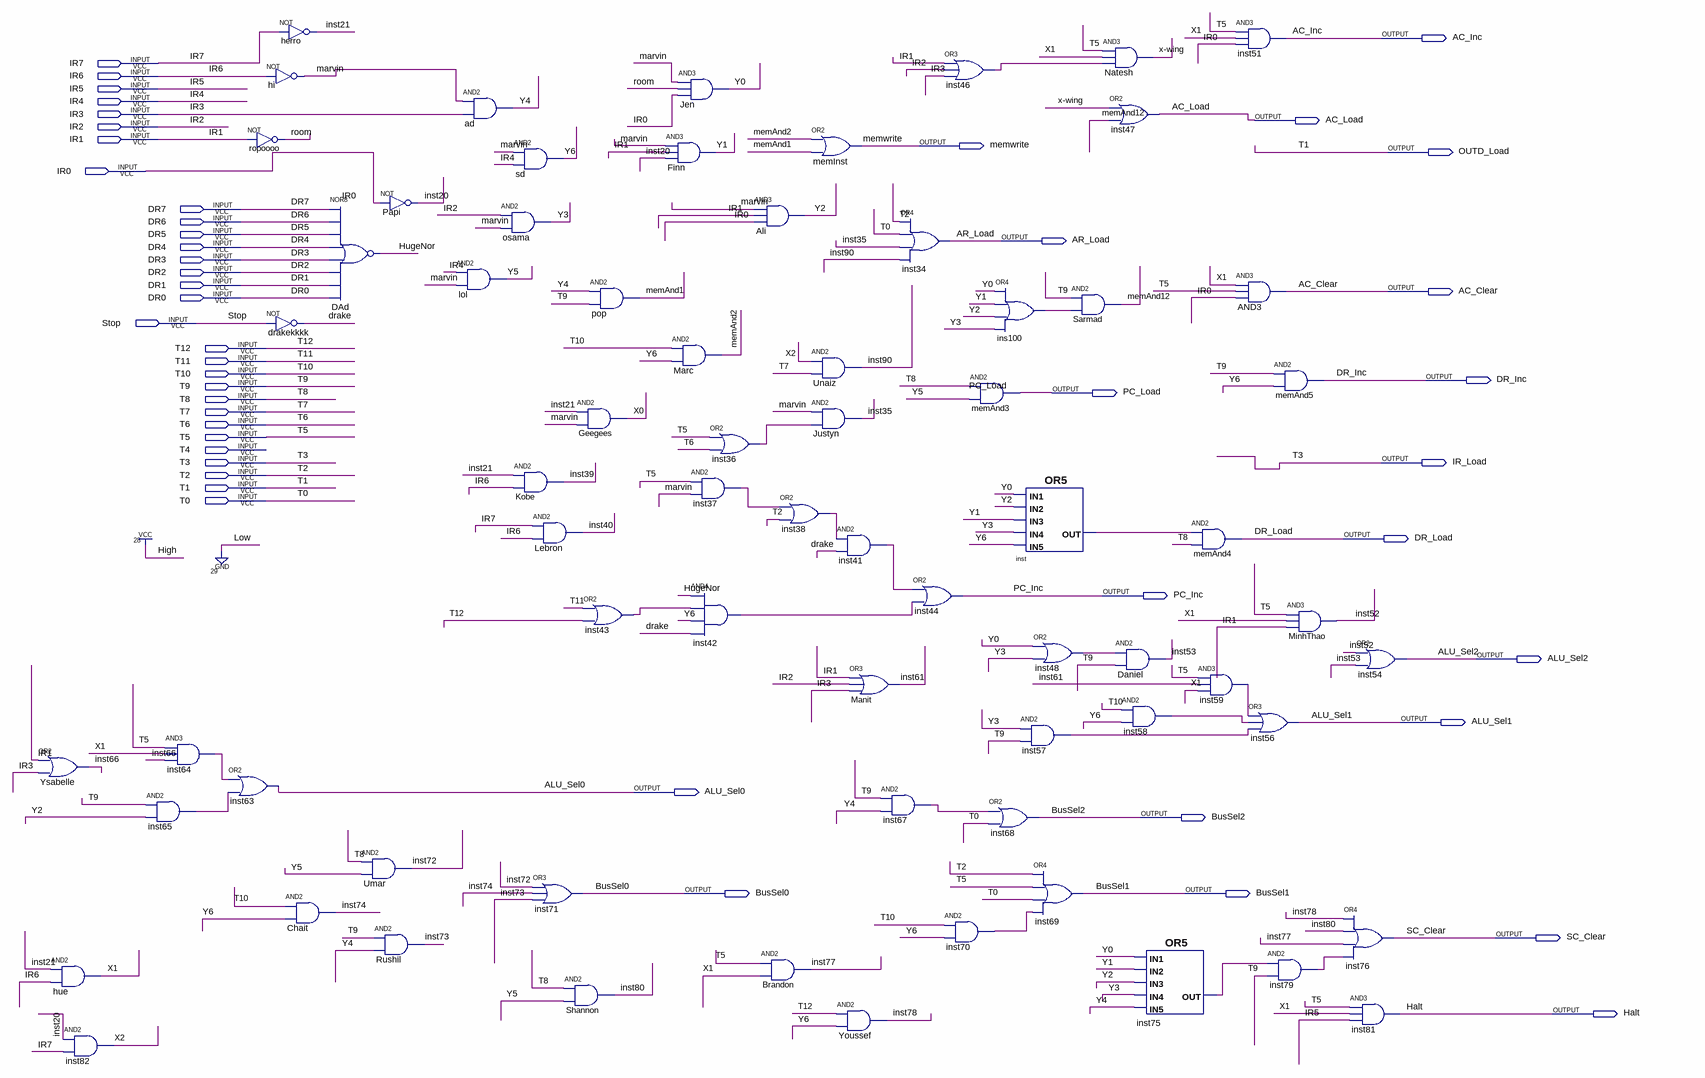
[diagram p0: schematic sheet]
// Quartus schematic lab3controller.bdf as structural Verilog: 70 symbols, 49 pins
module lab3controller (
  input  IR7,
  input  IR6,
  input  IR5,
  input  IR4,
  input  IR3,
  input  IR2,
  input  IR1,
  input  IR0,
  input  DR7,
  input  DR6,
  input  DR5,
  input  DR4,
  input  DR3,
  input  DR2,
  input  DR1,
  input  DR0,
  input  Stop,
  input  T12,
  input  T11,
  input  T10,
  input  T9,
  input  T8,
  input  T7,
  input  T6,
  input  T5,
  input  T4,
  input  T3,
  input  T2,
  input  T1,
  input  T0,
  output AC_Inc,
  output AC_Load,
  output memwrite,
  output OUTD_Load,
  output AR_Load,
  output AC_Clear,
  output DR_Inc,
  output PC_Load,
  output IR_Load,
  output DR_Load,
  output PC_Inc,
  output ALU_Sel2,
  output ALU_Sel1,
  output ALU_Sel0,
  output BusSel2,
  output BusSel0,
  output BusSel1,
  output SC_Clear,
  output Halt
);

  wire drake, HugeNor, ins100_out, inst20, inst21, inst35, inst36_out, inst37_out, inst38_out, inst39,
       inst40, inst41_out, inst42_out, inst43_out, inst46_out, inst48_out, inst52, inst53, inst57_out,
       inst58_out, inst59_out, inst61, inst64_out, inst65_out, inst66, inst67_out, inst70_out, inst72,
       inst73, inst74, inst75_out, inst77, inst78, inst79_out, inst80, inst90, inst_out, marvin, memAnd1,
       memAnd2, memAnd12, room, X0, X1, X2, \x-wing , Y0, Y1, Y2, Y3, Y4, Y5, Y6;

  or Ysabelle (inst66, IR1, IR3);
  and hue (X1, inst21, IR6);
  and inst82 (X2, inst20, IR7);
  and inst65 (inst65_out, T9, Y2);
  and inst64 (inst64_out, T5, X1, inst66);
  not ropoooo (room, IR1);
  or inst63 (ALU_Sel0, inst64_out, inst65_out);
  not herro (inst21, IR7);
  not hi (marvin, IR6);
  not drakekkkk (drake, Stop);
  and Chait (inst74, T10, Y6);
  nor DAd (HugeNor, DR7, DR6, DR5, DR4, DR3, DR2, DR1, DR0);
  not Papi (inst20, IR0);
  and Umar (inst72, T8, Y5);
  and Rushil (inst73, T9, Y4);
  and lol (Y5, IR4, marvin);
  and ad (Y4, marvin, IR3);
  and osama (Y3, IR2, marvin);
  and sd (Y6, marvin, IR4);
  and Kobe (inst39, inst21, IR6);
  and Lebron (inst40, IR7, IR6);
  or inst71 (BusSel0, inst72, inst74, inst73);
  and pop (memAnd1, Y4, T9);
  and Geegees (X0, inst21, marvin);
  or inst43 (inst43_out, T11, T12);
  and Shannon (inst80, T8, Y5);
  and Jen (Y0, marvin, room, IR0);
  and Finn (Y1, marvin, IR1, inst20);
  and Marc (memAnd2, T10, Y6);
  or inst36 (inst36_out, T5, T6);
  and inst37 (inst37_out, T5, marvin);
  and inst42 (inst42_out, HugeNor, inst43_out, Y6, drake);
  and Ali (Y2, marvin, IR1, IR0);
  and Brandon (inst77, T5, X1);
  or memInst (memwrite, memAnd2, memAnd1);
  and Unaiz (inst90, X2, T7);
  and Justyn (inst35, marvin, inst36_out);
  or inst38 (inst38_out, inst37_out, T2);
  and inst41 (inst41_out, inst38_out, drake);
  or Manit (inst61, IR1, IR2, IR3);
  and Youssef (inst78, T12, Y6);
  or inst34 (AR_Load, T2, T0, inst35, inst90);
  or inst44 (PC_Inc, inst41_out, inst42_out);
  and inst67 (inst67_out, T9, Y4);
  or inst46 (inst46_out, IR1, IR2, IR3);
  and inst70 (inst70_out, T10, Y6);
  or ins100 (ins100_out, Y0, Y1, Y2, Y3);
  and memAnd3 (PC_Load, T8, Y5);
  or inst (inst_out, Y0, Y2, Y1, Y3, Y6);
  or inst68 (BusSel2, inst67_out, T0);
  or inst48 (inst48_out, Y0, Y3);
  and inst57 (inst57_out, Y3, T9);
  or inst69 (BusSel1, T2, T5, T0, inst70_out);
  and Natesh (\x-wing , T5, X1, inst46_out);
  or inst47 (AC_Load, \x-wing , memAnd12);
  and Sarmad (memAnd12, T9, ins100_out);
  and Daniel (inst53, inst48_out, T9);
  and inst58 (inst58_out, T10, Y6);
  or inst75 (inst75_out, Y0, Y1, Y2, Y3, Y4);
  and memAnd4 (DR_Load, inst_out, T8);
  and inst59 (inst59_out, T5, inst61, X1);
  and inst51 (AC_Inc, T5, X1, IR0);
  and AND3 (AC_Clear, X1, T5, IR0);
  or inst56 (ALU_Sel1, inst59_out, inst58_out, inst57_out);
  and inst79 (inst79_out, inst75_out, T9);
  and memAnd5 (DR_Inc, T9, Y6);
  and MinhThao (inst52, T5, X1, IR1);
  or inst54 (ALU_Sel2, inst52, inst53);
  or inst76 (SC_Clear, inst78, inst80, inst77, inst79_out);
  and inst81 (Halt, T5, X1, IR5);

  assign IR_Load = T3;
  assign OUTD_Load = T1;
endmodule
